# Altium schematic sheet 02_DAC_Audio.SchDoc
size A4; SheetNumber: 2; SheetTotal: 4
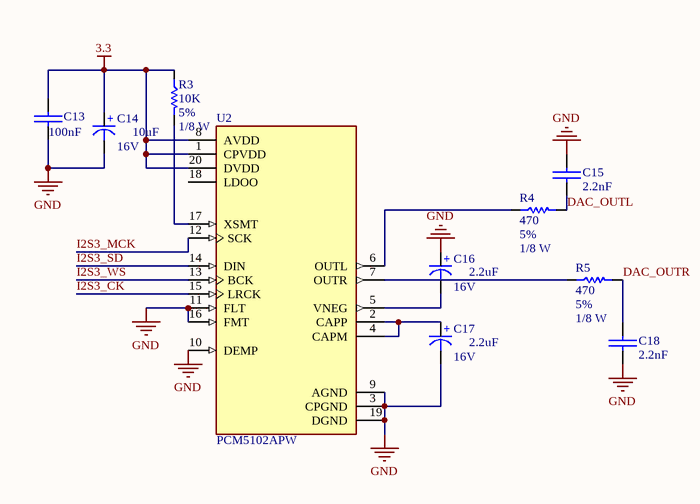
[diagram p0: 02_DAC_Audio.SchDoc]

## Parts
C13  100nF  [SMD_CAP_1206]
C14  Voltage: 16V  [cap 01]  (hidden comment: 10uF)
C15  2.2nF  [SMD_CAP_1206]
C16  Voltage: 16V  [cap 01]  (hidden comment: 2.2uF)
C17  Voltage: 16V  [cap 01]  (hidden comment: 2.2uF)
C18  2.2nF  [SMD_CAP_1206]
R3  Tolerance: 5%  Power: 1/8 W  [RES 0805 (2012X06L)]  (hidden comment: 10K)
R4  Tolerance: 5%  Power: 1/8 W  [RES 0805 (2012X06L)]  (hidden comment: 470)
R5  Tolerance: 5%  Power: 1/8 W  [RES 0805 (2012X06L)]  (hidden comment: 470)
U2  PCM5102APW  [SOP65P640X120-20N]

## Nets
3.3: C13.1(+) C14.1(+) R3.1 U2.1(CPVDD) U2.8(AVDD) U2.20(DVDD)
GND: C13.2(-) C14.2(-) C15.1(+) C16.1(+) C17.2(-) C18.2(-) U2.3(CPGND) U2.9(AGND) U2.10(DEMP) U2.11(FLT) U2.16(FMT) U2.19(DGND)
DAC_OUTL: C15.2(-) R4.2
DAC_OUTR: C18.1(+) R5.2
I2S3_CK: U2.15(LRCK)
I2S3_MCK: U2.12(SCK)
I2S3_SD: U2.14(DIN)
I2S3_WS: U2.13(BCK)
NetC16_2: C16.2(-) U2.5(VNEG)
NetC17_1: C17.1(+) U2.2(CAPP) U2.4(CAPM)
NetR3_2: R3.2 U2.17(XSMT)
NetR4_1: R4.1 U2.6(OUTL)
NetR5_1: R5.1 U2.7(OUTR)

Not connected (* = marked no-connect by the designer): U2 18(LDOO)

## Library data of the parts
C13 C15 C18 = Cap-Bipolar: Bipolar Capacitor; Voltage: 100V; Designer: Saeid Jorablo; Organazation: ControTec; Adding Date: 1387/12/20
  C13: Value: 100nF
  C15 C18: Value: 2.2nF
C14 C16 C17 = Cap-Polar: Polar Capacitor; Designer: Saeid Jorablo; Organazation: ControTec; Adding Date: 1387/12/20
  C14: Value: 10uF
  C16 C17: Value: 2.2uF
R3-R5 = Resistor
  R3: Value: 10K
  R4 R5: Value: 470
U2 = PCM5102APW: 2VRMS DirectPathâ„¢, DAC estÃ©reo de Ã¡udio de 112dB com interface PCM de 32 bits e 384kHz 20-TSSOP -25 a 85; MF: Texas Instruments; Purchase-URL: https://pricing.snapeda.com/search/part/PCM5102APW/?ref=eda; MP: PCM5102APW; Value: *; Availability: In Stock; Check_prices: https://www.snapeda.com/parts/PCM5102APW/Texas+Instruments/view-part/?ref=eda; SnapEDA_Link: https://www.snapeda.com/parts/PCM5102APW/Texas+Instruments/view-part/?ref=snap; Price: None; Package: TSSOP-20 Texas Instruments